# Altium project Gas_Level_and_Safety.PrjPcb
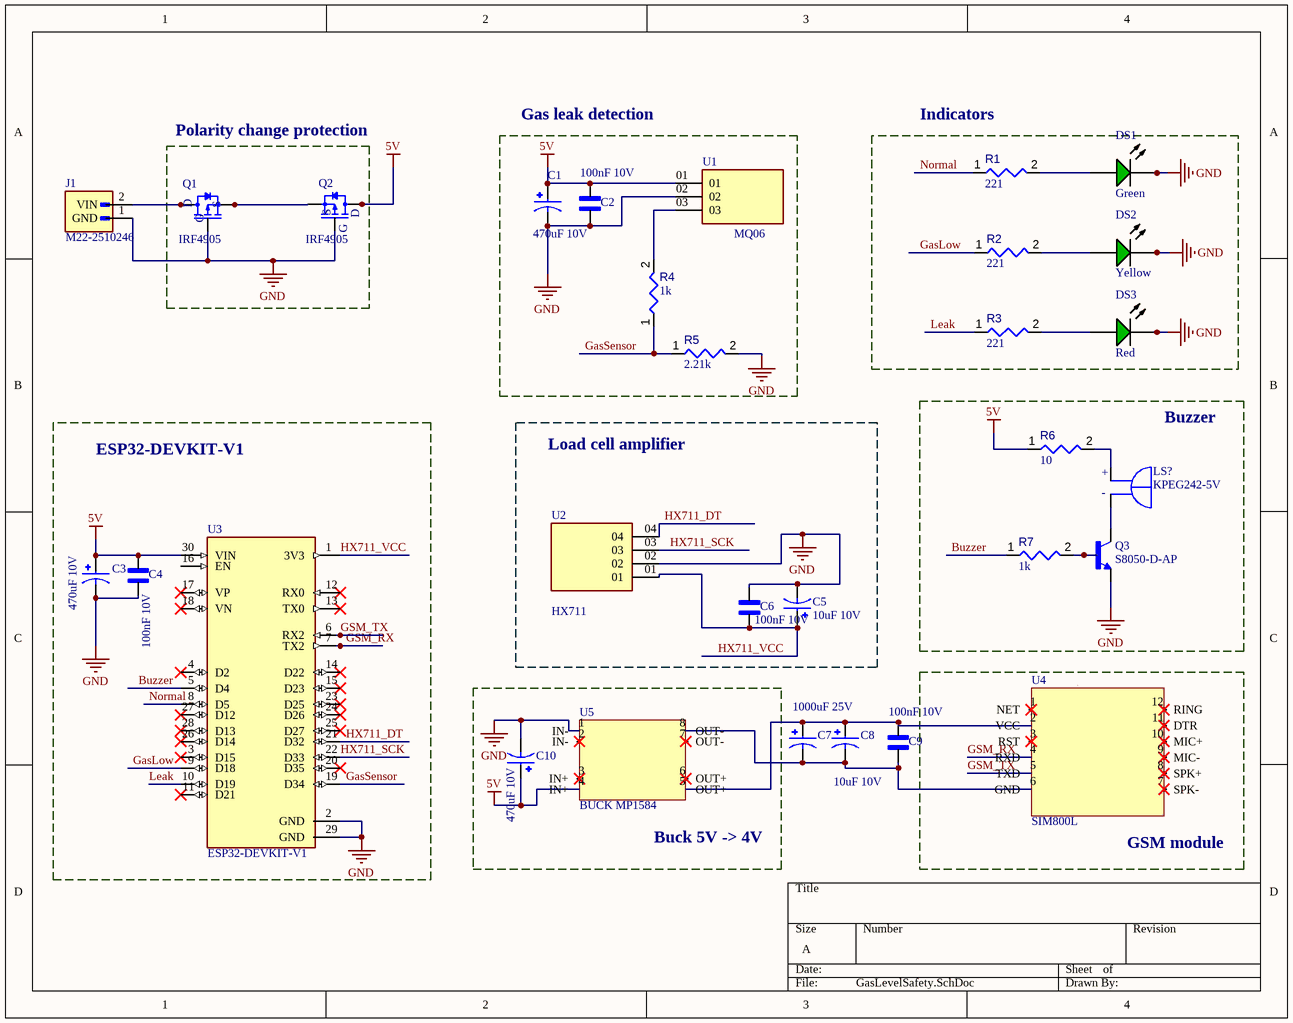
[diagram p0: GasLevelSafety.SchDoc]
1 sheet, 30 parts. Net scope: global (net labels, ports and power ports of the same name join across sheets).
Board file: GasLevelSafety.PcbDoc

## Sheet GasLevelSafety.SchDoc
size A; SheetNumber: 1; SheetTotal: 1

### Parts
C1  value 470uF 10V  [CAPPRD200W45D500H500]
C2  value 100nF 10V  [CAPRR254W54L381T254H466B]  (hidden comment: C315C104K5R5TA)
C3  value 470uF 10V  [CAPPRD200W45D500H500]
C4  value 100nF 10V  [CAPRR254W54L381T254H466B]  (hidden comment: C315C104K5R5TA)
C5  value 10uF 10V  [CAPPRD200W45D500H500]
C6  value 100nF 10V  [CAPRR254W54L381T254H466B]  (hidden comment: C315C104K5R5TA)
C7  value 1000uF 25V  [CAPPRD500W60D1000H2500]  (hidden comment: EEUFS1V102LB)
C8  value 10uF 10V  [CAPPRD200W45D500H500]
C9  value 100nF 10V  [CAPRR254W54L381T254H466B]  (hidden comment: C315C104K5R5TA)
C10  value 470uF 10V  [CAPPRD200W45D500H500]
DS1  Green  [CGX-G502DC]
DS2  Yellow  [CGX-G502DC]
DS3  Red  [CGX-G502DC]
J1  M22-2510246  [HARWIN_M22-2510246]
LS?  KPEG242-5V  [XDCR_KPEG242-5V]
Q1  value IRF4905  [TO-220]  (hidden comment: DIP-MOSFET-P-CH-60V-27A(TO-220))
Q2  value IRF4905  [TO-220]  (hidden comment: DIP-MOSFET-P-CH-60V-27A(TO-220))
Q3  S8050-D-AP  [TO92250P457H470-3B]
R1  value 221  [RESA60-630X240]  (hidden comment: MFR-25FBF52-221R)
R2  value 221  [RESA60-630X240]  (hidden comment: MFR-25FBF52-221R)
R3  value 221  [RESA60-630X240]  (hidden comment: MFR-25FBF52-221R)
R4  value 1k  [RESA60-630X240]  (hidden comment: MFR-25FBF52-1K)
R5  value 2.21k  [RESA60-630X240]  (hidden comment: MFR-25FBF52-2K21)
R6  value 10  [RESA60-630X240]  (hidden comment: MFR-25FBF52-10K)
R7  value 1k  [RESA60-630X240]  (hidden comment: MFR-25FBF52-1K)
U1  value MQ06  [SAMTEC_TSW-103-08-L-S-LL]  (hidden comment: TSW-103-08-L-S-LL)
U2  value HX711  [SAMTEC_TSW-104-13-G-S]  (hidden comment: TSW-104-13-G-S)
U3  ESP32-DEVKIT-V1  [MODULE_ESP32_DEVKIT_V1]
U4  SIM800L  [SIM800L]
U5  BUCK MP1584  [MP1584]

### Blocks framed on the sheet
Polarity change protection: Q1 Q2
Gas leak detection: C1 C2 R4 R5 U1
Indicators: DS1-DS3 R1-R3
ESP32-DEVKIT-V1: C3 C4 U3
Load cell amplifier: C5 C6 U2
Buzzer: LS? Q3 R6 R7
Buck 5V -> 4V: C10 U5
GSM module: U4

### Nets
5V: C1.P C2.2 C3.P C4.2 C10.P Q2.2(D) Q2.HEAT(D) R6.1 U1.01 U3.30(VIN) U5.4(IN+)
GND: C1.N C2.1 C3.N C4.1 C5.N C6.1 C10.N DS1.2(K) DS2.2(K) DS3.2(K) J1.1(GND) Q1.1(G) Q2.1(G) Q3.1(E) R5.2 U1.02 U2.02 U3.2(GND) U3.29(GND) U5.1(IN-)
Buzzer: R7.1 U3.5(D4)
GasLow: R2.1 U3.9(D18)
GasSensor: R4.1 R5.1 U3.19(D34)
GSM_RX: U3.7(TX2) U4.4(RXD)
GSM_TX: U3.6(RX2) U4.5(TXD)
HX711_DT: U2.04 U3.21(D32)
HX711_SCK: U2.03 U3.22(D33)
HX711_VCC: C5.P C6.2 U2.01 U3.1(3V3)
Leak: R3.1 U3.10(D19)
Normal: R1.1 U3.8(D5)
NetC7_N: C7.N C8.N C9.1 U4.6(GND) U5.8(OUT-)
NetC7_P: C7.P C8.P C9.2 U4.2(VCC) U5.5(OUT+)
NetDS1_1: DS1.1(A) R1.2
NetDS2_1: DS2.1(A) R2.2
NetDS3_1: DS3.1(A) R3.2
NetJ1_2: J1.2(VIN) Q1.2(D) Q1.HEAT(D)
NetLS?_N: LS?.N(NEG) Q3.3(C)
NetLS?_P: LS?.P(POS) R6.2
NetQ1_3: Q1.3(S) Q2.3(S)
NetQ3_2: Q3.2(B) R7.2
NetR4_2: R4.2 U1.03

Not connected (* = marked no-connect by the designer): U3 3(D15)* 4(D2)* 11(D21)* 12(RX0)* 13(TX0)* 14(D22)* 15(D23)* 16(EN) 17(VP)* 18(VN)* 20(D35)* 23(D25)* 24(D26)* 25(D27)* 26(D14)* 27(D12)* 28(D13)*; U4 1(NET)* 3(RST)* 7(SPK-)* 8(SPK+)* 9(MIC-)* 10(MIC+)* 11(DTR)* 12(RING)*; U5 2(IN-)* 3(IN+)* 6(OUT+)* 7(OUT-)*

### Notes on the sheet
- (in symbol KPEG242-5V) +; -

### Library data of the parts
C1 C3 C5 C8 C10 = ECEA1HKS4R7: Capacitor; Aluminum Electrolytic; Cap 4.7uF; Vol-Rtg 50V; Radial; Ks; Height 5mm; MF: Panasonic; MP: ECE-A1HKS4R7; Availability: In Stock; Check_prices: https://www.snapeda.com/parts/ECE-A1HKS4R7/Panasonic/view-part/2302906/?ref=eda; Package: RADIAL-2 Panasonic; Price: None; SnapEDA_Link: https://www.snapeda.com/parts/ECE-A1HKS4R7/Panasonic/view-part/2302906/?ref=snap
C2 C4 C6 C9 = C315C104K5R5TA: Capacitor, Ceramic, 100nF, 50VDC, 10-% Tol, 10+% Tol, X7R-TC Code, -15, 15%-TC; MF: KEMET; SnapEDA_Link: https://www.snapeda.com/parts/C315C104K5R5TA/KEMET/view-part/?ref=snap; Package: RADIAL-2 KEMET; MP: C315C104K5R5TA; Check_prices: https://www.snapeda.com/parts/C315C104K5R5TA/KEMET/view-part/?ref=eda
C7 = EEUFS1V102LB: CAP ALUM 1000UF 20% 35V RADIAL; MF: Panasonic Electronic Components; MP: EEU-FS1V102LB; Package: RADIAL-2 Panasonic; Purchase-URL: https://pricing.snapeda.com/search/part/EEU-FS1V102LB/?ref=eda; Availability: In Stock; SnapEDA_Link: https://www.snapeda.com/parts/EEU-FS1V102LB/Panasonic/view-part/6221050/?ref=snap; Price: None; Check_prices: https://www.snapeda.com/parts/EEU-FS1V102LB/Panasonic/view-part/6221050/?ref=eda
DS1-DS3 = CMP-007-00008-2: Green LED, 80 mW, 20 mA, -25 to 85 degC, 2-Pin THD; Manufacturer: Shenzhen CGX; Mounting Technology: TH; Package Reference: G502DC; Datasheet Version: Sep-14; Manufacturer URL: http://szcgx.com/; Package Description: 2-Pin Through Hole Device, Dia 5.9 mm; Datasheet URL: http://datasheet.octopart.com/G502DC-Chengguangxing-datasheet-62330340.pdf; Case/Package: G502DC; RoHS Compliant: Unknown
J1 = M22-2510246: 2.00mm (0.079) Pitch SIL Vertical 2.4mm Throughboard Pin Header, 3.5mm mating pin height, tin, 2 contacts; MF: Harwin; SnapEDA_Link: https://www.snapeda.com/parts/M22-2510246/Harwin/view-part/?ref=snap; Package: None; Value: *; MP: M22-2510246; Check_prices: https://www.snapeda.com/parts/M22-2510246/Harwin/view-part/?ref=eda
Q1 Q2 = DIP-MOSFET-P-CH-60V-27A(TO-220): IRF4905 P-Channel MOSFET 55V 74A 200W (TO-220); MF: ON Semiconductor; MP: FQP27P06; SnapEDA_Link: https://www.snapeda.com/parts/FQP27P06/Onsemi/view-part/?ref=snap; Package: TO-220-3 ON; Check_prices: https://www.snapeda.com/parts/FQP27P06/Onsemi/view-part/?ref=eda
Q3 = S8050-D-AP: Bipolar (BJT) Transistor NPN 25 V 500 mA 150MHz 625 mW Through Hole TO-92; MF: Micro Commercial Co; SnapEDA_Link: https://www.snapeda.com/parts/S8050-D-AP/Micro+Commercial/view-part/?ref=snap; Package: TO-92 MCC; Value: *; MP: S8050-D-AP; Check_prices: https://www.snapeda.com/parts/S8050-D-AP/Micro+Commercial/view-part/?ref=eda
R1-R3 = CMP-009-00051-4: Axial Resistor, 221 Ohm, +/- 1%, 250 mW, -55 to 155 degC, 2-Pin THD, RoHS, Bulk; Manufacturer: Yageo; Power: 250mW; Voltage Rating: 250V; Package Quantity: 200; Manufacturer URL: http://www.yageo.com/; Case/Package: Axial; Package Reference: MFR-25; RoHS Compliant: True; Mounting Technology: TH; Datasheet URL: http://www.yageo.com/documents/recent/Yageo%20LR_MFR_2013.pdf; Packaging: Bulk; Package Description: 2-Pin Axial Lead, Dia 2.4 mm, Body Length 6.3 mm; Max Operating Temperature: 155°C; Tolerance: 1%; Datasheet Version: Apr-13; Min Operating Temperature: -55°C
R4 R7 = CMP-009-00048-4: Axial Resistor, 1 KOhm, +/- 1%, 250 mW, -55 to 155 degC, 2-Pin THD, RoHS, Bulk; Manufacturer: Yageo; Voltage Rating: 250V; Power: 250mW; Min Operating Temperature: -55°C; Max Operating Temperature: 155°C; Tolerance: 1%; Package Reference: MFR-25; Composition: CarbonFilm; Mounting Technology: TH; Packaging: Bulk; Case/Package: Axial; Datasheet URL: http://www.yageo.com/documents/recent/Yageo%20LR_MFR_2013.pdf; Package Quantity: 200; Manufacturer URL: http://www.yageo.com/; Package Description: 2-Pin Axial Lead, Dia 2.4 mm, Body Length 6.3 mm; Datasheet Version: Apr-13; RoHS Compliant: True
R5 = CMP-009-00054-4: Axial Resistor, 2.21 KOhm, +/- 1%, 0.25 W, -55 to 155 degC, 2-Pin THD, RoHS, Bulk; Manufacturer: Yageo; Voltage Rating: 250V; Power: 250mW; Tolerance: 1%; Package Reference: MFR-25; Packaging: Bulk; Datasheet Version: Apr-13; Manufacturer URL: http://www.yageo.com/; Package Description: 2-Pin Axial Lead, Dia 2.4 mm, Body Length 6.3 mm; Mounting Technology: TH; RoHS Compliant: True; Package Quantity: 200; Min Operating Temperature: -55°C; Case/Package: Axial; Max Operating Temperature: 155°C; Datasheet URL: http://www.yageo.com/documents/recent/Yageo%20LR_MFR_2013.pdf
R6 = CMP-009-00047-4: Axial Resistor, 10 KOhm, +/- 1%, 0.25 W, -55 to 155 degC, 2-Pin THD, RoHS, Bulk; Manufacturer: Yageo; Power: 250mW; Voltage Rating: 250V; Manufacturer URL: http://www.yageo.com/; Datasheet URL: http://www.yageo.com/documents/recent/Yageo%20LR_MFR_2013.pdf; Package Reference: MFR-25; Min Operating Temperature: -55°C; Mounting Technology: TH; Package Quantity: 200; Case/Package: Axial; Tolerance: 1%; RoHS Compliant: True; Datasheet Version: Apr-13; Packaging: Bulk; Max Operating Temperature: 155°C; Package Description: 2-Pin Axial Lead, Dia 2.4 mm, Body Length 6.3 mm
U3 = ESP32-DEVKIT-V1: Dual core, Wi-Fi: 2.4 GHz up to 150 Mbits/s,BLE (Bluetooth Low Energy) and legacy Bluetooth, 32 bits, Up to 240 MHz; MF: Do it; SnapEDA_Link: https://www.snapeda.com/parts/ESP32-DEVKIT-V1/Do+it/view-part/?ref=snap; Package: None; Value: *; MP: ESP32-DEVKIT-V1; Check_prices: https://www.snapeda.com/parts/ESP32-DEVKIT-V1/Do+it/view-part/?ref=eda
U4 U5 = Component_1
LS? = KPEG242-5V: Availability: Unavailable; Price: None; Package: None; Value: *; MP: KPEG242-5V
U1 = TSW-103-08-L-S-LL: Package: None; Price: None; MP: TSW-103-08-L-S-LL; Availability: Unavailable
U2 = TSW-104-13-G-S: Package: None; Price: None; MP: TSW-104-13-G-S; Availability: Unavailable